# EAGLE design ESP32_WROOM_Testboard (EAGLE 7.1.0)
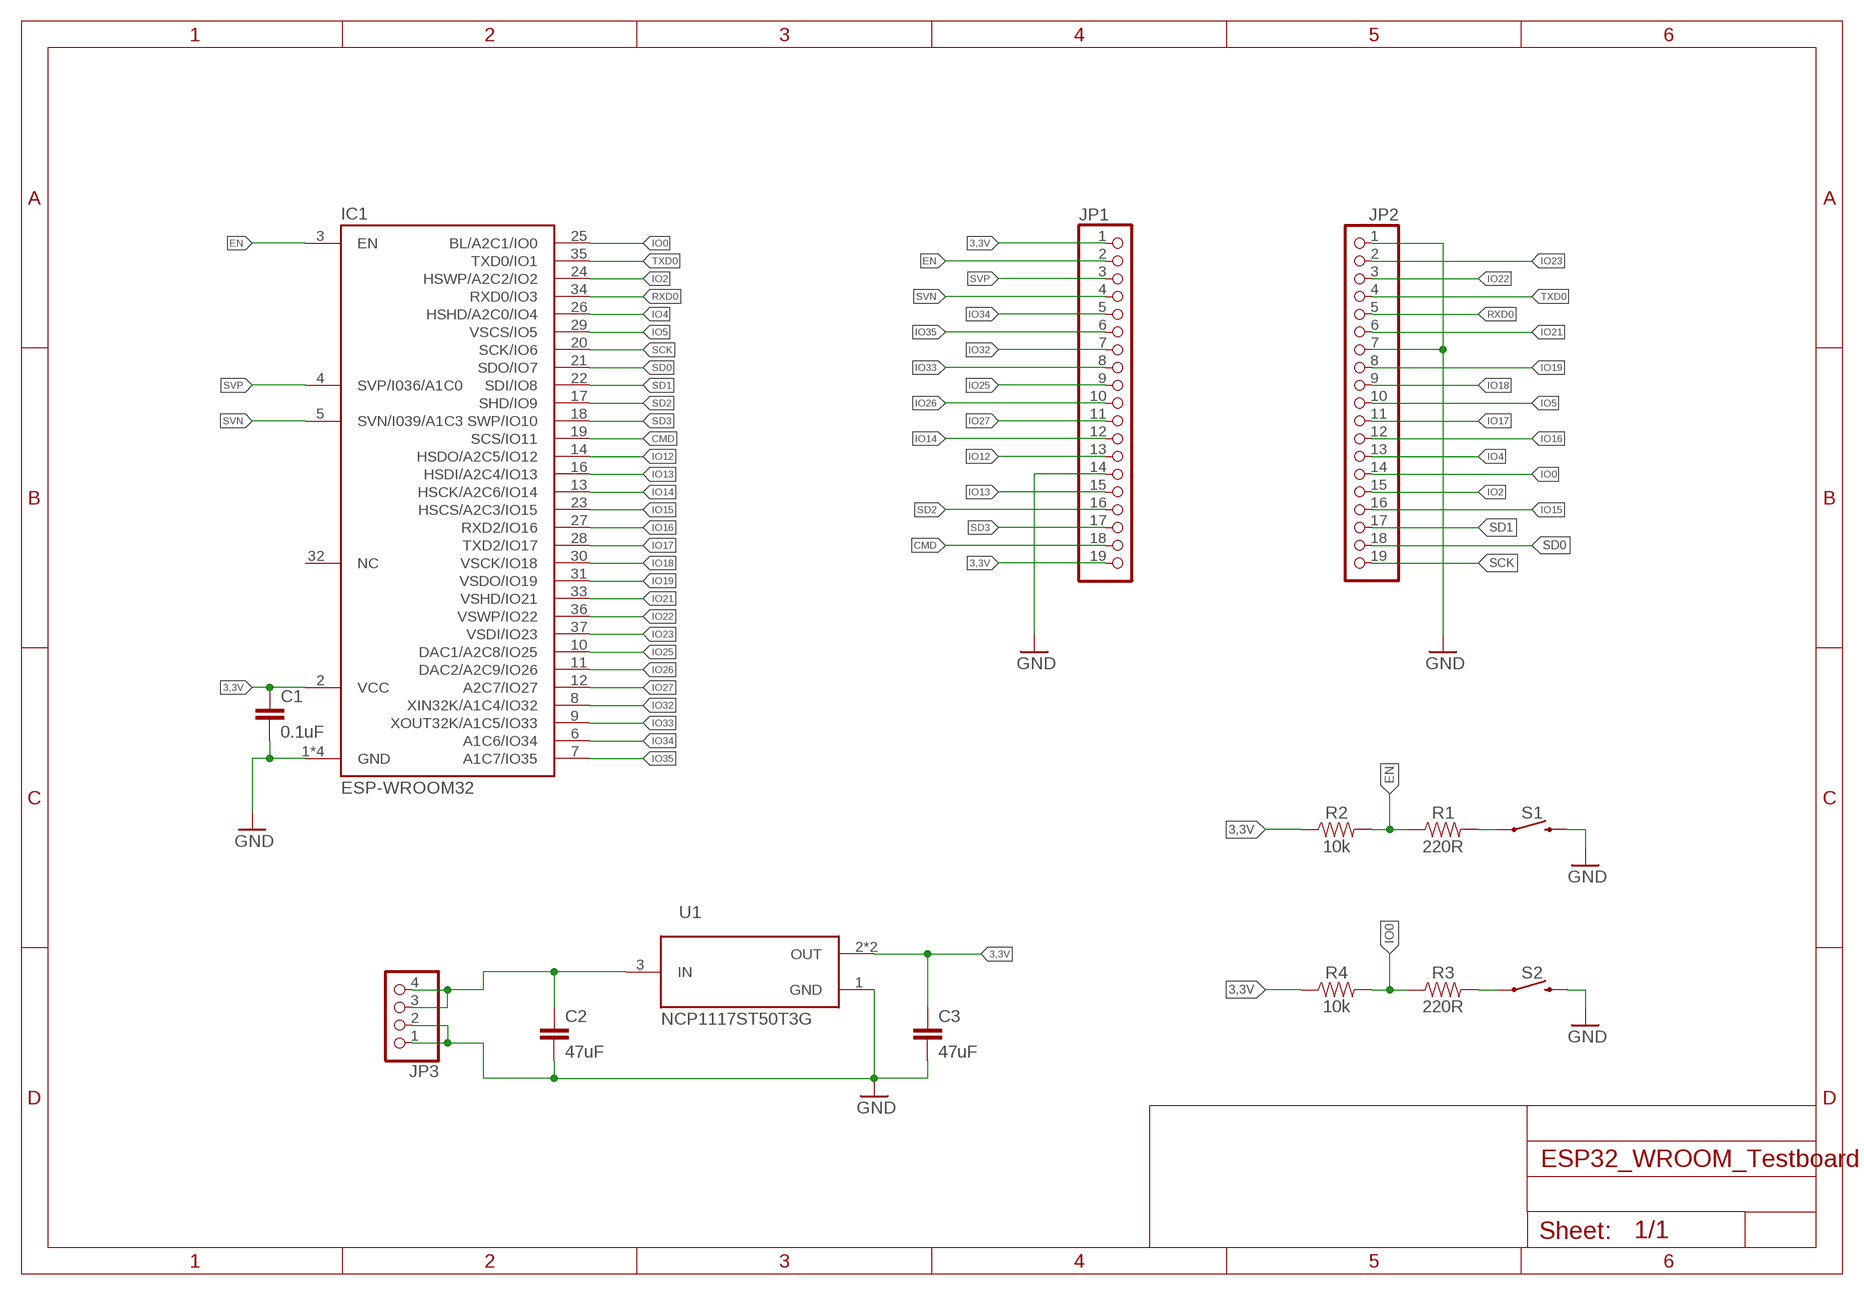
[diagram p0: schematic, sheet 1]

## Parts
C1  0.1uF  0.1UF-0603-25V-(+80/-20%)  [0603]
C2  47uF  0.1UF-0603-25V-(+80/-20%)  [0603]
C3  47uF  0.1UF-0603-25V-(+80/-20%)  [0603]
IC1  ESP-WROOM32  [ESP-WROOM32]
JP1  PINHD-1X19  [1X19]
JP2  PINHD-1X19  [1X19]
JP3  PINHD-1X4  [1X04]
R1  220R  0.3OHM-0805-1/8W-1%  [0805]
R2  10k  0.3OHM-0805-1/8W-1%  [0805]
R3  220R  0.3OHM-0805-1/8W-1%  [0805]
R4  10k  0.3OHM-0805-1/8W-1%  [0805]
S1  MOMENTARY-SWITCH-SPST-SMD-5.2-REDUNDANT  [TACTILE_SWITCH_SMD_5.2MM]
S2  MOMENTARY-SWITCH-SPST-SMD-5.2-REDUNDANT  [TACTILE_SWITCH_SMD_5.2MM]
U1  NCP1117ST50T3G  [SOT230P700X180-4N]

## Nets
3,3V: C1.1 C3.1 IC1.2(VCC) JP1.1 JP1.19 R2.1 R4.1 U1.2(OUT) U1.4(OUT)
CMD: IC1.19(SCS/IO11) JP1.18
EN: IC1.3(EN) JP1.2 R1.1 R2.2
GND: C1.2 C2.2 C3.2 IC1.1(GND) IC1.15(GND) IC1.38(GND) IC1.TP(GND) JP1.14 JP2.1 JP2.7 JP3.1 JP3.2 S1.3 S1.4 S2.3 S2.4 U1.1(GND)
IO0: IC1.25(BL/A2C1/IO0) JP2.14 R3.1 R4.2
IO2: IC1.24(HSWP/A2C2/IO2) JP2.15
IO4: IC1.26(HSHD/A2C0/IO4) JP2.13
IO5: IC1.29(VSCS/IO5) JP2.10
IO12: IC1.14(HSDO/A2C5/IO12) JP1.13
IO13: IC1.16(HSDI/A2C4/IO13) JP1.15
IO14: IC1.13(HSCK/A2C6/IO14) JP1.12
IO15: IC1.23(HSCS/A2C3/IO15) JP2.16
IO16: IC1.27(RXD2/IO16) JP2.12
IO17: IC1.28(TXD2/IO17) JP2.11
IO18: IC1.30(VSCK/IO18) JP2.9
IO19: IC1.31(VSDO/IO19) JP2.8
IO21: IC1.33(VSHD/IO21) JP2.6
IO22: IC1.36(VSWP/IO22) JP2.3
IO23: IC1.37(VSDI/IO23) JP2.2
IO25: IC1.10(DAC1/A2C8/IO25) JP1.9
IO26: IC1.11(DAC2/A2C9/IO26) JP1.10
IO27: IC1.12(A2C7/IO27) JP1.11
IO32: IC1.8(XIN32K/A1C4/IO32) JP1.7
IO33: IC1.9(XOUT32K/A1C5/IO33) JP1.8
IO34: IC1.6(A1C6/IO34) JP1.5
IO35: IC1.7(A1C7/IO35) JP1.6
N$2: C2.1 JP3.3 JP3.4 U1.3(IN)
N$3: R1.2 S1.1 S1.2
N$5: R3.2 S2.1 S2.2
RXD0: IC1.34(RXD0/IO3) JP2.5
SCK: IC1.20(SCK/IO6) JP2.19
SD0: IC1.21(SDO/IO7) JP2.18
SD1: IC1.22(SDI/IO8) JP2.17
SD2: IC1.17(SHD/IO9) JP1.16
SD3: IC1.18(SWP/IO10) JP1.17
SVN: IC1.5(SVN/I039/A1C3) JP1.4
SVP: IC1.4(SVP/I036/A1C0) JP1.3
TXD0: IC1.35(TXD0/IO1) JP2.4
Unconnected: IC1.32(NC)

## Library data of the parts
C1 = SparkFun-Capacitors:0.1UF: 0.1µF ceramic capacitors A capacitor is a passive two-terminal electrical component used to store electrical energy temporarily in an electric field.; PROD_ID: CAP-00810
C2 C3 = SparkFun-Capacitors:0.1UF: 0.1µF ceramic capacitors A capacitor is a passive two-terminal electrical component used to store electrical energy temporarily in an electric field.; PROD_ID: CAP-00810; VALUE: 0.1uF
IC1 = we-chip:ESP-WROOM32: Espressif ESP-WROOM-32 ESP32 WiFi/WLAN + Bluetooth/BLE Module Compatible with AI-Thinker ESP-32S Module.
JP1 JP2 = pinhead:PINHD-1X19: PIN HEADER
JP3 = pinhead:PINHD-1X4: PIN HEADER
R1-R4 = SparkFun-Resistors:0.3OHM: 0.3Ω resistor A resistor is a passive two-terminal electrical component that implements electrical resistance as a circuit element. Resistors act to reduce current flow, and, at the same time, act to lower voltage levels within circuits. - Wikipedia; PROD_ID: RES-11622; VALUE: 0.3
S1 S2 = SparkFun-Switches:MOMENTARY-SWITCH-SPST: Momentary Switch (Pushbutton) - SPST Normally-open (NO) SPST momentary switches (buttons, pushbuttons). Variants PTH-12MM - 12mm square, through-hole Momentary Pushbutton Switch - 12mm Square <https://www.sparkfun.com/products/9190> (COM-09190) PTH-6.0MM, PTH-6.0MM-KIT - 6.0mm square, through-hole Mini Pushbutton Switch <https://www.sparkfun.com/products/97> (COM-00097) KIT package intended for soldering kit's - only one side of pads' copper is exposed. PTH-RIGHT-ANGLE-KIT - Right-angle, through-hole Right Angle Tactile Button <https://www.sparkfun.com/products/10791> - Used on SparkFun BigTime Watch Kit <https://www.sparkfun.com/products/11734> SMD-12MM - 12mm square, surface-mount Tactile Button - SMD (12mm) <https://www.sparkfun.com/products/12993> (COM-12993) Used on SparkFun PicoBoard <https://www.sparkfun.com/products/11888> SMD-4.5MM - 4.5mm Square Trackball Switch Used on SparkFun Blackberry Trackballer Breakout <https://www.sparkfun.com/products/13169> SMD-4.6MMX2.8MM - 4.60mm x 2.80mm, surface mount Used on SparkFun SAMD21 Mini Breakout <https://www.sparkfun.com/products/13664> SMD-5.2MM, SMD-5.2-REDUNDANT - 5.2mm square, surface-mount Mini Pushbutton Switch - SMD <https://www.sparkfun.com/products/8720> (COM-08720) Used on Arduino Pro Mini <https://www.sparkfun.com/products/11114> REDUNDANT package connects both switch circuits together SMD-6.0X3.5MM - 6.0 x 3.5mm, surface mount Momentary Reset Switch SMD <https://www.sparkfun.com/products/8229> (COM-08229) SMD-6.2MM-TALL - 6.2mm square, surface mount Tactile Button - SMD (6mm) <https://www.sparkfun.com/products/12992> Used on SparkFun Digital Sandbox <https://www.sparkfun.com/products/12651> SMD-RIGHT-ANGLE - Right-angle, surface mount Used on SparkFun Block for Intel® Edison - Arduino <https://www.sparkfun.com/products/13036>; PROD_ID: SWCH-08247; SF_SKU: COM-08720
U1 = NCP1117ST50T3G:NCP1117ST50T3G: 1.0 A Low-Dropout Positive ,Fixed and Adjustable,Voltage Regulators; AVAILABILITY: Good; DESCRIPTION: 1.0 A Positive LDO Linear Voltage Regulator (Fixed and Adjustable) Vout: 5.0 V; MF: ON Semiconductor; MP: NCP1117ST50T3G; PACKAGE: SOT-223-3 ON Semiconductor; PRICE: 0.23 USD

## Board
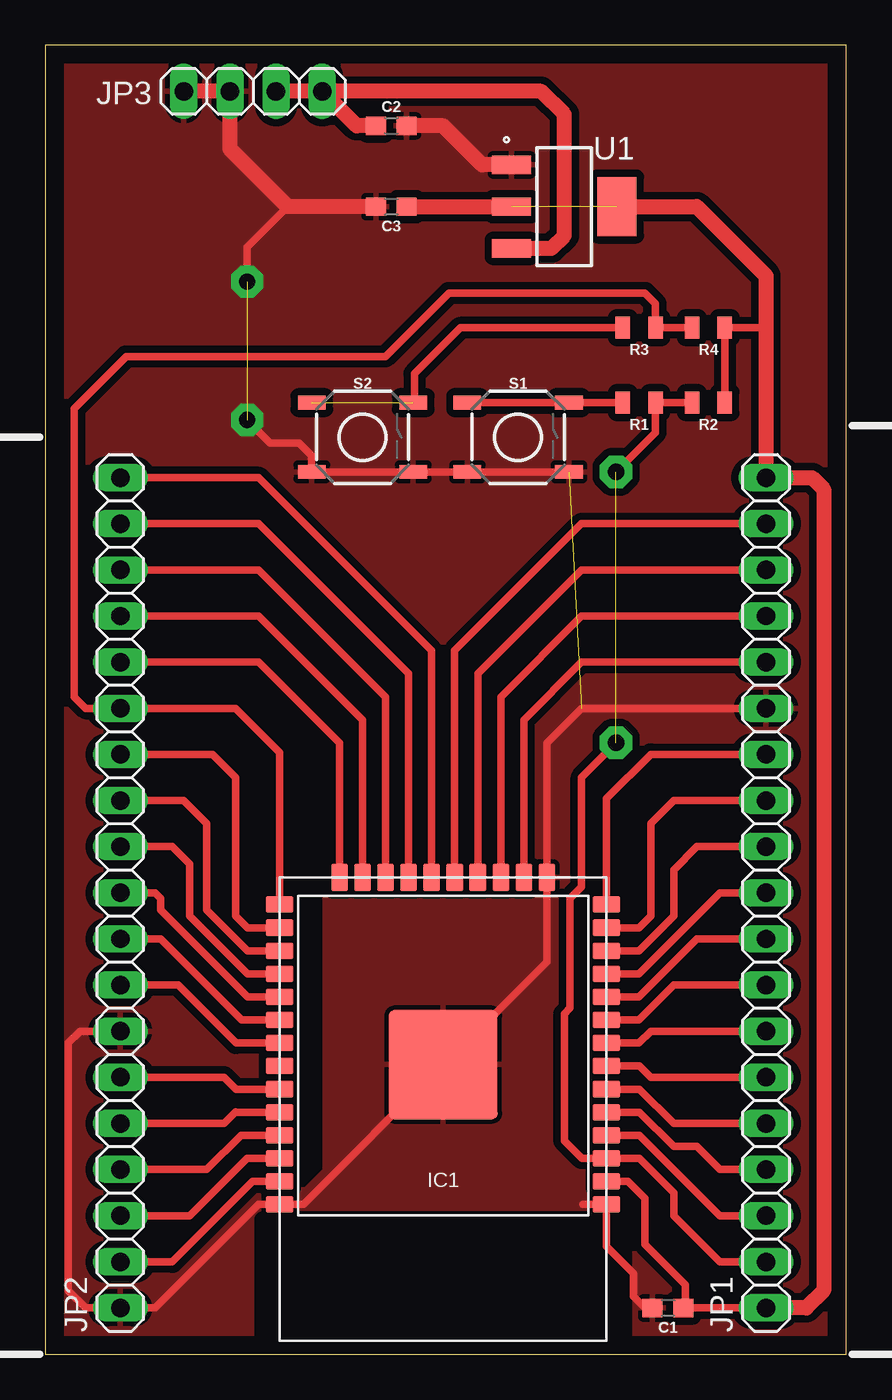
[diagram p1: board, top side]

Size 44.11 x 72.06 mm. Coordinates in mm from the lower left corner, seen from the top.
Outline: 0,0 44.11,0 44.11,72.06 0,72.06 0,0
Copper layers (1*16): Top 0.035mm / dielectric 1.5mm / Bottom 0.035mm
Design rules "default": minimum track width 10mil, minimum drill 24mil, track to track 8mil, track to pad 8mil, pad to pad 8mil, via to via 8mil, smd to smd 8mil, copper to edge 40mil, drill to drill 8mil, minimum pad ring 10mil, minimum via ring 8mil, stop-mask expansion 4mil, vias tented up to drill 0mil, thermal gap 10mil

### Footprints (pad centres in the part's own frame; a part is rotated, then mirrored left to right if it is on the bottom)
0603 = smd 1.1 x 1: 1 -0.85,0; 2 0.85,0
ESP-WROOM32 = smd 1.5 x 0.9: 1 -9,7; 2 -9,5.73; 3 -9,4.46; 4 -9,3.19; 5 -9,1.92; 6 -9,0.65; 7 -9,-0.62; 8 -9,-1.89; 9 -9,-3.16; 10 -9,-4.43; 11 -9,-5.7; 12 -9,-6.97; 13 -9,-8.24; 14 -9,-9.51; 25 9,-9.51; 26 9,-8.24; 27 9,-6.97; 28 9,-5.7; 29 9,-4.43; 30 9,-3.16; 31 9,-1.89; 32 9,-0.62; 33 9,0.65; 34 9,1.92; 35 9,3.19; 36 9,4.46; 37 9,5.73; 38 9,7 | smd 0.9 x 1.5: 15 -5.715,-11; 16 -4.445,-11; 17 -3.175,-11; 18 -1.905,-11; 19 -0.635,-11; 20 0.635,-11; 21 1.905,-11; 22 3.175,-11; 23 4.445,-11; 24 5.715,-11 | smd 6 x 6: TP 0,-0.7
1X19 = drill 1.016 long: 1 -22.86,0; 2 -20.32,0; 3 -17.78,0; 4 -15.24,0; 5 -12.7,0; 6 -10.16,0; 7 -7.62,0; 8 -5.08,0; 9 -2.54,0; 10 0,0; 11 2.54,0; 12 5.08,0; 13 7.62,0; 14 10.16,0; 15 12.7,0; 16 15.24,0; 17 17.78,0; 18 20.32,0; 19 22.86,0
1X04 = drill 1.016 long: 1 -3.81,0; 2 -1.27,0; 3 1.27,0; 4 3.81,0
0805 = smd 0.8 x 1.2: 1 -0.9,0; 2 0.9,0
TACTILE_SWITCH_SMD_5.2MM = smd 1.524 x 0.762: 1 -2.794,1.905; 2 2.794,1.905; 3 -2.794,-1.905; 4 2.794,-1.905
SOT230P700X180-4N = smd 2.15 x 1: 1 -2.9,2.3; 2 -2.9,0; 3 -2.9,-2.3 | smd 2.15 x 3.25: 4 2.9,0

### Placement (x,y rotation side)
C1  34.29,2.54 180 top
C2  19.05,67.63 0 top
C3  19.05,63.18 180 top
IC1  21.91,15.24 180 top
JP1  39.69,25.4 90 top
JP2  4.13,25.4 90 top
JP3  11.43,69.53 0 top
R1  32.7,52.39 180 top
R2  36.51,52.39 180 top
R3  32.7,56.52 180 top
R4  36.51,56.52 180 top
S1  26.04,50.48 0 top
S2  17.46,50.48 0 top
U1  28.57,63.18 0 top

### Tracks (layer width: path | path; a pad name or v marks a point on that pad's centre or on a via)
3,3V  (1 unrouted)
  Top 0.406: IC1.2 32.08,9.51 33.02,8.57 33.02,6.03 35.24,3.81 35.24,2.64 C1.1 JP1.1 | R2.1 R4.1 39.69,56.52 39.69,56.83
  Top 0.813: C3.1 U1.2 | U1.4 35.88,63.18 39.69,59.37 39.69,56.83 JP1.19 42.23,48.26 42.86,47.62 42.86,3.49 41.91,2.54 JP1.1
CMD
  Top 0.406: IC1.19 22.54,38.73 29.53,45.72 JP1.18
EN  (via drill 0.9 pad 1.78)  (1 unrouted)
  Top 0.406: JP1.2 37.15,5.08 34.61,7.62 34.61,8.89 32.72,10.78 IC1.3 29.54,10.78 28.58,11.75 28.58,18.73 28.89,19.05 28.89,25.08 29.53,25.72 29.53,31.75 31.43,33.66 | R2.2 R1.1 33.6,50.75 v31.43,48.58
GND  (via drill 0.9 pad 1.78)  (2 unrouted)
  Top 0.406: JP1.14 29.53,35.56 27.62,33.66 IC1.15 27.62,21.59 21.97,15.94 IC1.TP | IC1.TP 14.21,8.24 IC1.38 11.73,8.24 6.03,2.54 JP2.1 2.22,2.54 1.27,3.49 1.27,17.14 1.91,17.78 JP2.7 | IC1.TP 21.91,15.88 | 30.89,8.26 IC1.1 | 30.89,8.26 30.89,5.94 32.38,4.45 32.38,3.17 33.02,2.54 C1.2 | 30.89,8.26 29.59,8.26 | S1.4 S1.3 S2.4 S2.3 14.67,49.47 13.97,50.16 12.38,50.16 v11.11,51.44 | 13.34,63.18 11.11,60.96 v11.11,59.05
  Top 0.813: U1.1 24.05,65.48 21.91,67.63 C2.2 | C3.2 13.34,63.18 10.16,66.36 JP3.2 JP3.1
  pour Top (isolate 0.406): 0.32,71.75 43.81,71.75 43.81,0.32 31.75,0.32 31.75,6.99 12.06,6.99 12.06,0.32 0.32,0.32
IO0
  Top 0.406: IC1.25 12.91,33.13 10.48,35.56 JP2.14 2.22,35.56 1.59,36.2 1.59,52.07 4.44,54.93 18.73,54.93 22.22,58.42 33.02,58.42 33.6,57.84 R3.1 R4.2
IO2
  Top 0.406: IC1.24 16.19,33.66 11.75,38.1 JP2.15
IO4
  Top 0.406: IC1.26 11.13,23.48 10.48,24.13 10.48,31.75 9.21,33.02 JP2.13
IO5
  Top 0.406: IC1.29 11.13,19.67 6.35,24.45 6.35,25.08 6.03,25.4 JP2.10
IO12
  Top 0.406: IC1.14 30.91,30.59 33.34,33.02 JP1.13
IO13
  Top 0.406: IC1.16 26.35,34.92 29.53,38.1 JP1.15
IO14
  Top 0.406: IC1.13 32.69,23.48 33.34,24.13 33.34,29.21 34.61,30.48 JP1.12
IO15
  Top 0.406: IC1.23 17.46,34.92 11.75,40.64 JP2.16
IO16
  Top 0.406: IC1.27 11.13,22.21 8.89,24.45 8.89,29.21 7.62,30.48 JP2.12
IO17
  Top 0.406: IC1.28 11.13,20.94 7.94,24.13 7.94,26.99 6.98,27.94 JP2.11
IO18
  Top 0.406: IC1.30 10.81,18.4 6.35,22.86 JP2.9
IO19
  Top 0.406: IC1.31 10.49,17.13 7.3,20.32 JP2.8
IO21
  Top 0.406: IC1.33 10.49,14.59 9.84,15.24 JP2.6
IO22
  Top 0.406: IC1.36 11.1,10.78 7.94,7.62 JP2.3
IO23
  Top 0.406: IC1.37 11.42,9.51 6.98,5.08 JP2.2
IO25
  Top 0.406: IC1.10 32.69,19.67 35.88,22.86 JP1.9
IO26
  Top 0.406: IC1.11 32.69,20.94 37.15,25.4 JP1.10
IO27
  Top 0.406: IC1.12 32.69,22.21 34.61,24.13 34.61,26.67 35.88,27.94 JP1.11
IO32
  Top 0.406: IC1.8 32.69,17.13 33.34,17.78 JP1.7
IO33
  Top 0.406: IC1.9 32.69,18.4 34.61,20.32 JP1.8
IO34
  Top 0.406: IC1.6 32.72,14.59 34.61,12.7 JP1.5
IO35
  Top 0.406: IC1.7 32.72,15.86 33.34,15.24 JP1.6
N$1  (via drill 0.9 pad 1.78)
  other vias: 31.43,33.66
N$2
  Top 0.813: C2.1 17.14,67.63 JP3.4 | JP3.4 JP3.3 | U1.3 27.86,60.88 28.58,61.59 28.58,68.26 27.31,69.53 JP3.4
N$3
  Top 0.406: S1.1 S1.2 R1.2
N$5  (1 unrouted)
  Top 0.406: R3.2 22.86,56.52 20.32,53.98 20.32,52.45 S2.2
N$7
  cutout Top: 13.97,9.21 14.29,9.21 15.24,10.16 15.24,22.54 13.97,23.81
N$8
  cutout Top: 15.24,22.54 13.97,23.81 13.97,25.4 13.34,26.04 13.34,33.34 10.48,36.2 6.03,36.2 6.03,37.47 11.75,37.47 15.56,33.66 15.56,26.99 15.24,26.67 15.24,25.72
N$9
  cutout Top: 31.43,8.89 31.43,7.3 32.7,7.3 32.7,8.57 32.07,9.21 31.43,9.21
RXD0
  Top 0.406: IC1.34 10.49,13.32 10.48,13.34 9.84,12.7 JP2.5
SCK
  Top 0.406: IC1.20 21.27,38.73 11.75,48.26 JP2.19
SD0
  Top 0.406: IC1.21 20,37.47 11.75,45.72 JP2.18
SD1
  Top 0.406: IC1.22 18.73,36.2 11.75,43.18 JP2.17
SD2
  Top 0.406: IC1.17 25.08,36.2 29.53,40.64 JP1.16
SD3
  Top 0.406: IC1.18 23.81,37.47 29.53,43.18 JP1.17
SVN
  Top 0.406: IC1.5 32.72,13.32 34.61,11.43 35.88,11.43 37.15,10.16 JP1.4
SVP
  Top 0.406: IC1.4 32.72,12.05 37.15,7.62 JP1.3
TXD0
  Top 0.406: IC1.35 10.78,12.05 8.89,10.16 JP2.4

### Text on the board
bValues: GND | VBAT + | 3,3V | SCK | SD0 | 11 | 10 | SD1 | 15 | 9 | 2 | 13 | 0 | GND | Header JP1 | 4 | 12 | 16 | 14 | 17 | 27 | 26 | 5 | 18 | 25 | Header JP2 | 33 | 19 | GND | 32 | 35 | 21 | RXD0 | 34 | 39 | TXD0 | 22 | 36 | 23 | EN | GND | 3,3V